# EAGLE schematic 5volt_rail (EAGLE 7.0.0)
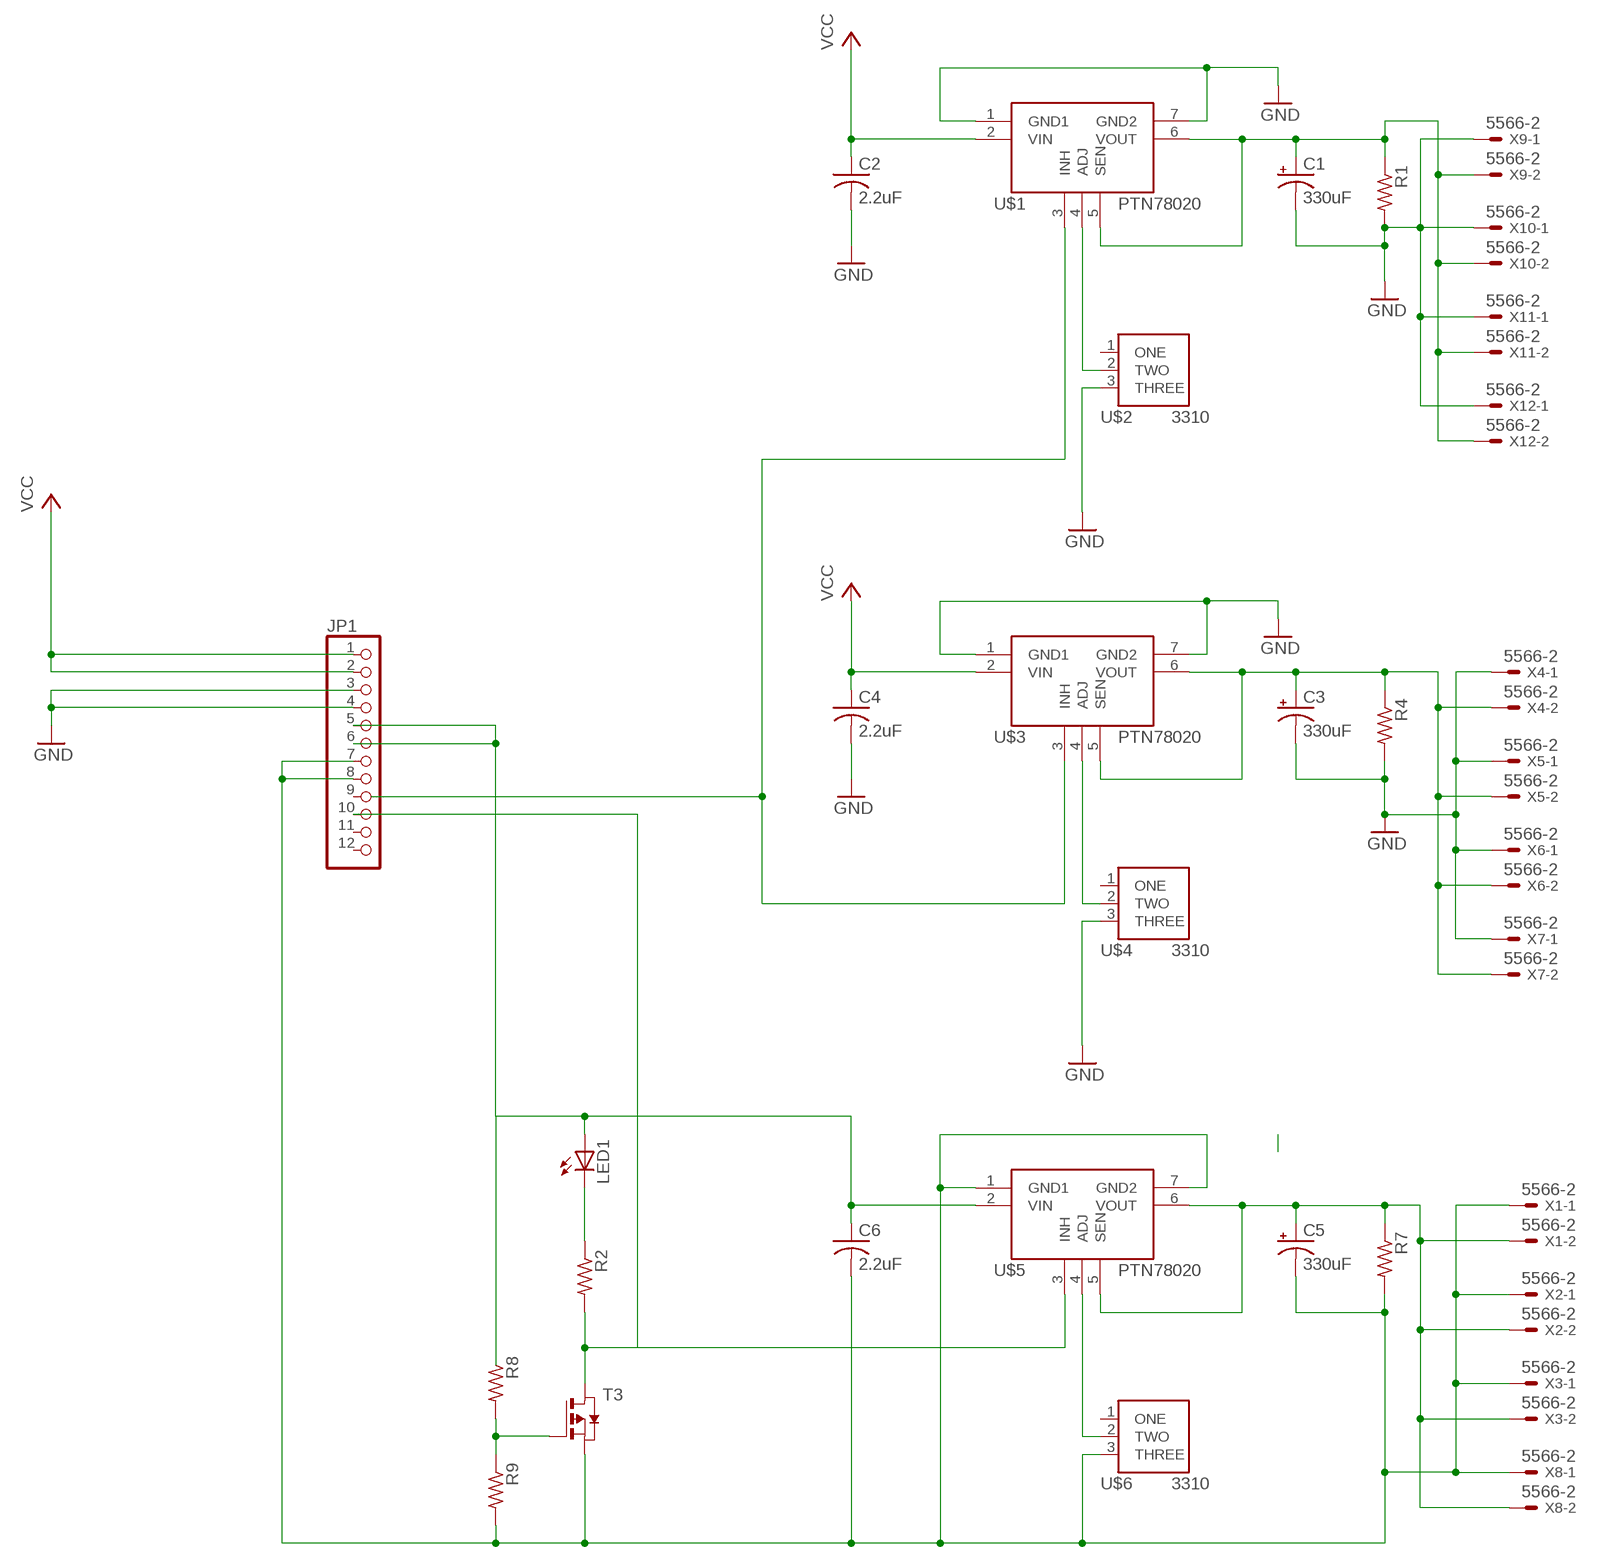
[diagram p0: schematic, sheet 1]

## Parts
C1  330uF  CPOL-USE5-10.5  [E5-10,5]
C2  2.2uF  C-USC0805  [C0805]
C3  330uF  CPOL-USE5-10.5  [E5-10,5]
C4  2.2uF  C-USC0805  [C0805]
C5  330uF  CPOL-USE5-10.5  [E5-10,5]
C6  2.2uF  C-USC0805  [C0805]
JP1  PINHD-1X12  [1X12]
LED1  LED5MM  [LED5MM]
R1  R-US_M0805  [M0805]
R2  R-US_M0805  [M0805]
R4  R-US_M0805  [M0805]
R7  R-US_M0805  [M0805]
R8  R-US_M0805  [M0805]
R9  R-US_M0805  [M0805]
T3  PMOSSOT223  [SOT223]
U$1  PTH78020-SMD  [PTN78020-SND]
U$2  3310-001  [3310-001-TH]
U$3  PTH78020-SMD  [PTN78020-SND]
U$4  3310-001  [3310-001-TH]
U$5  PTH78020-SMD  [PTN78020-SND]
U$6  3310-001  [3310-001-TH]
X1  5566-2  [5566-2]
X2  5566-2  [5566-2]
X3  5566-2  [5566-2]
X4  5566-2  [5566-2]
X5  5566-2  [5566-2]
X6  5566-2  [5566-2]
X7  5566-2  [5566-2]
X8  5566-2  [5566-2]
X9  5566-2  [5566-2]
X10  5566-2  [5566-2]
X11  5566-2  [5566-2]
X12  5566-2  [5566-2]

## Nets
GND: C1.- C2.2 C3.- C4.2 JP1.3 JP1.4 R1.2 R4.2 U$1.1(GND1) U$1.7(GND2) U$2.3(THREE) U$3.1(GND1) U$3.7(GND2) U$4.3(THREE) X4.1 X5.1 X6.1 X7.1 X9.1 X10.1 X11.1 X12.1
N$2: U$1.4(ADJ) U$2.2(TWO)
N$4: LED1.K(C) R2.1
N$7: JP1.10 R2.2 T3.2(D) T3.4(D) U$5.3(INH)
N$8: C1.+ R1.1 U$1.5(SEN) U$1.6(VOUT) X9.2 X10.2 X11.2 X12.2
N$9: U$1.3(INH) U$3.3(INH)
N$11: C6.1 JP1.5 JP1.6 LED1.A U$5.2(VIN)
N$12: U$3.4(ADJ) U$4.2(TWO)
N$13: C3.+ R4.1 U$3.5(SEN) U$3.6(VOUT) X4.2 X5.2 X6.2 X7.2
N$14: R8.2 R9.1 T3.1(G)
N$15: C5.+ R7.1 U$5.5(SEN) U$5.6(VOUT) X1.2 X2.2 X3.2 X8.2
N$17: U$5.4(ADJ) U$6.2(TWO)
N$19: C5.- C6.2 JP1.7 JP1.8 R7.2 R9.2 T3.3(S) U$5.1(GND1) U$5.7(GND2) U$6.3(THREE) X1.1 X2.1 X3.1 X8.1
VCC: C2.1 C4.1 JP1.1 JP1.2 U$1.2(VIN) U$3.2(VIN)
Unconnected: JP1.9 JP1.11 JP1.12 R8.1 U$2.1(ONE) U$4.1(ONE) U$6.1(ONE)

## Library data of the parts
C1 C3 C5 = rcl:CPOL-US: POLARIZED CAPACITOR, American symbol
C2 C4 C6 = adafruit:C-US: CAPACITOR, American symbol
JP1 = adafruit:PINHD-1X12: PIN HEADER
LED1 = adafruit:LED: LED OSRAM: - CHIPLED LG R971, LG N971, LY N971, LG Q971, LY Q971, LO R971, LY R971 LH N974, LH R974 LS Q976, LO Q976, LY Q976 LO Q996 - Hyper CHIPLED LW Q18S LB Q993, LB Q99A, LB R99A - SideLED LS A670, LO A670, LY A670, LG A670, LP A670 LB A673, LV A673, LT A673, LW A673 LH A674 LY A675 LS A676, LA A676, LO A676, LY A676, LW A676 LS A679, LY A679, LG A679 - Hyper Micro SIDELED® LS Y876, LA Y876, LO Y876, LY Y876 LT Y87S - SmartLED LW L88C, LW L88S LB L89C, LB L89S, LG L890 LS L89K, LO L89K, LY L89K LS L896, LA L896, LO L896, LY L896 - TOPLED LS T670, LO T670, LY T670, LG T670, LP T670 LSG T670, LSP T670, LSY T670, LOP T670, LYG T670 LG T671, LOG T671, LSG T671 LB T673, LV T673, LT T673, LW T673 LH T674 LS T676, LA T676, LO T676, LY T676, LB T676, LH T676, LSB T676, LW T676 LB T67C, LV T67C, LT T67C, LS T67K, LO T67K, LY T67K, LW E67C LS E67B, LA E67B, LO E67B, LY E67B, LB E67C, LV E67C, LT E67C LW T67C LS T679, LY T679, LG T679 LS T770, LO T770, LY T770, LG T770, LP T770 LB T773, LV T773, LT T773, LW T773 LH T774 LS E675, LA E675, LY E675, LS T675 LS T776, LA T776, LO T776, LY T776, LB T776 LHGB T686 LT T68C, LB T68C - Hyper Mini TOPLED® LB M676 - Mini TOPLED Santana® LG M470 LS M47K, LO M47K, LY M47K Source: http://www.osram.convergy.de/
R1 R2 R4 R7-R9 = adafruit:R-US_: RESISTOR, American symbol
T3 = zetex:PMOSSOT223: MOS FET; OC_FARNELL: unknown; OC_NEWARK: unknown
U$1 U$3 U$5 = PTN78020:PTH78020-SMD
U$2 U$4 U$6 = 3310-001:3310-001
X1-X12 = con-molex:5566-2: Mini FIT connector 2 pol Source: http://www.molex.com; OC_FARNELL: 1822072; OC_NEWARK: unknown